# Altium schematic sheet Data Storage.SchDoc: Data Storage
size B; DrawnBy: Jasper Yun; SheetNumber: 8; SheetTotal: 11; Competition: SAC 2021; Subteam: Avionics; University: McGill University; Location: Montreal, Quebec; Project: Avionics Project Name; MRT: McGill Rocket Team
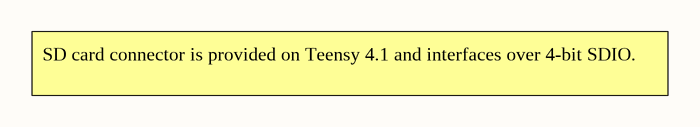
[diagram p0: Data Storage.SchDoc]

## Notes on the sheet
- SD card connector is provided on Teensy 4.1 and interfaces over 4-bit SDIO.
- Title
- Size:
- Date:
- B
- Revision:
- Time:
- Drawn By:
- Sheet
- of
- File: